# Altium project v3score.PrjPCB
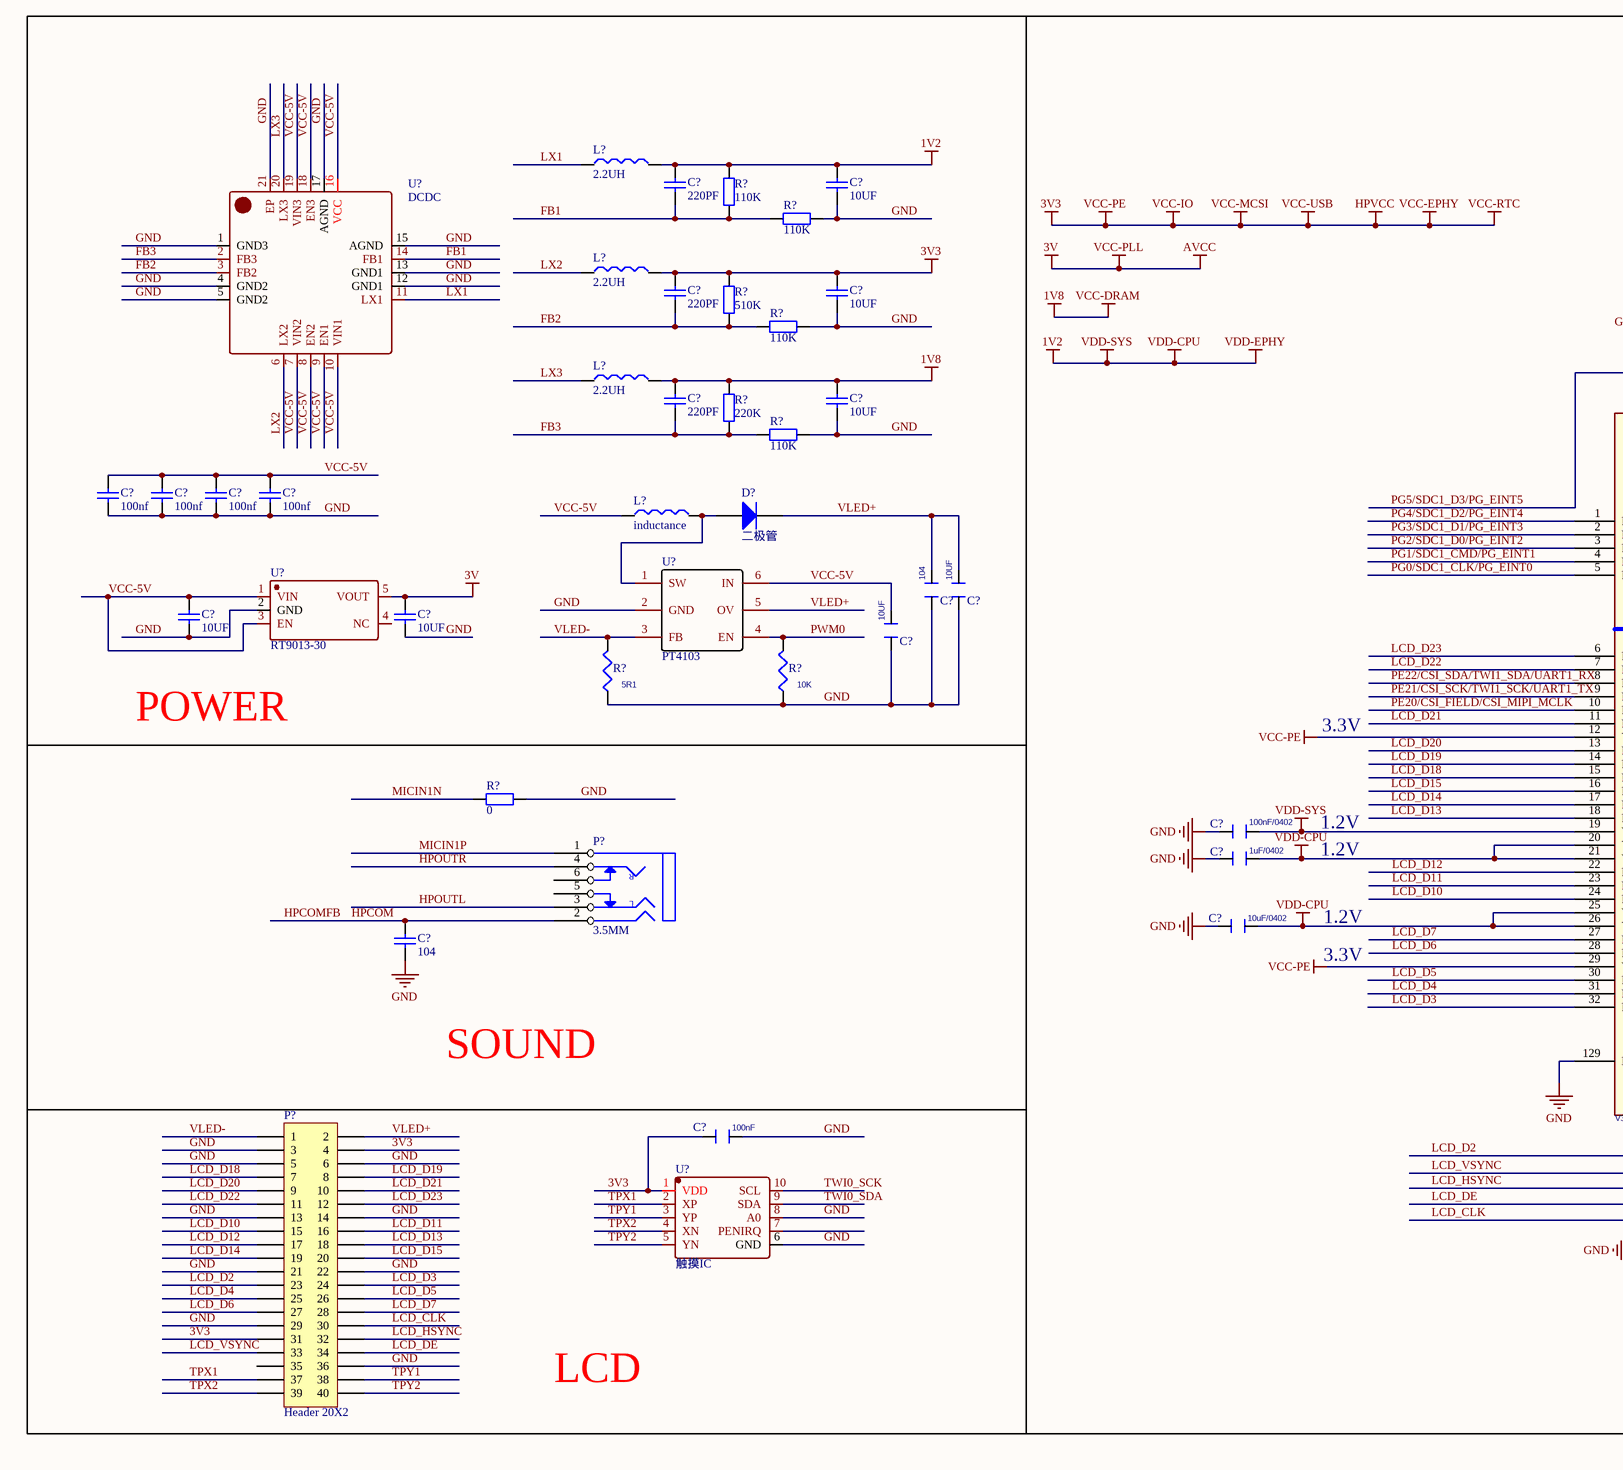
[diagram p0: v3score.SchDoc, left]
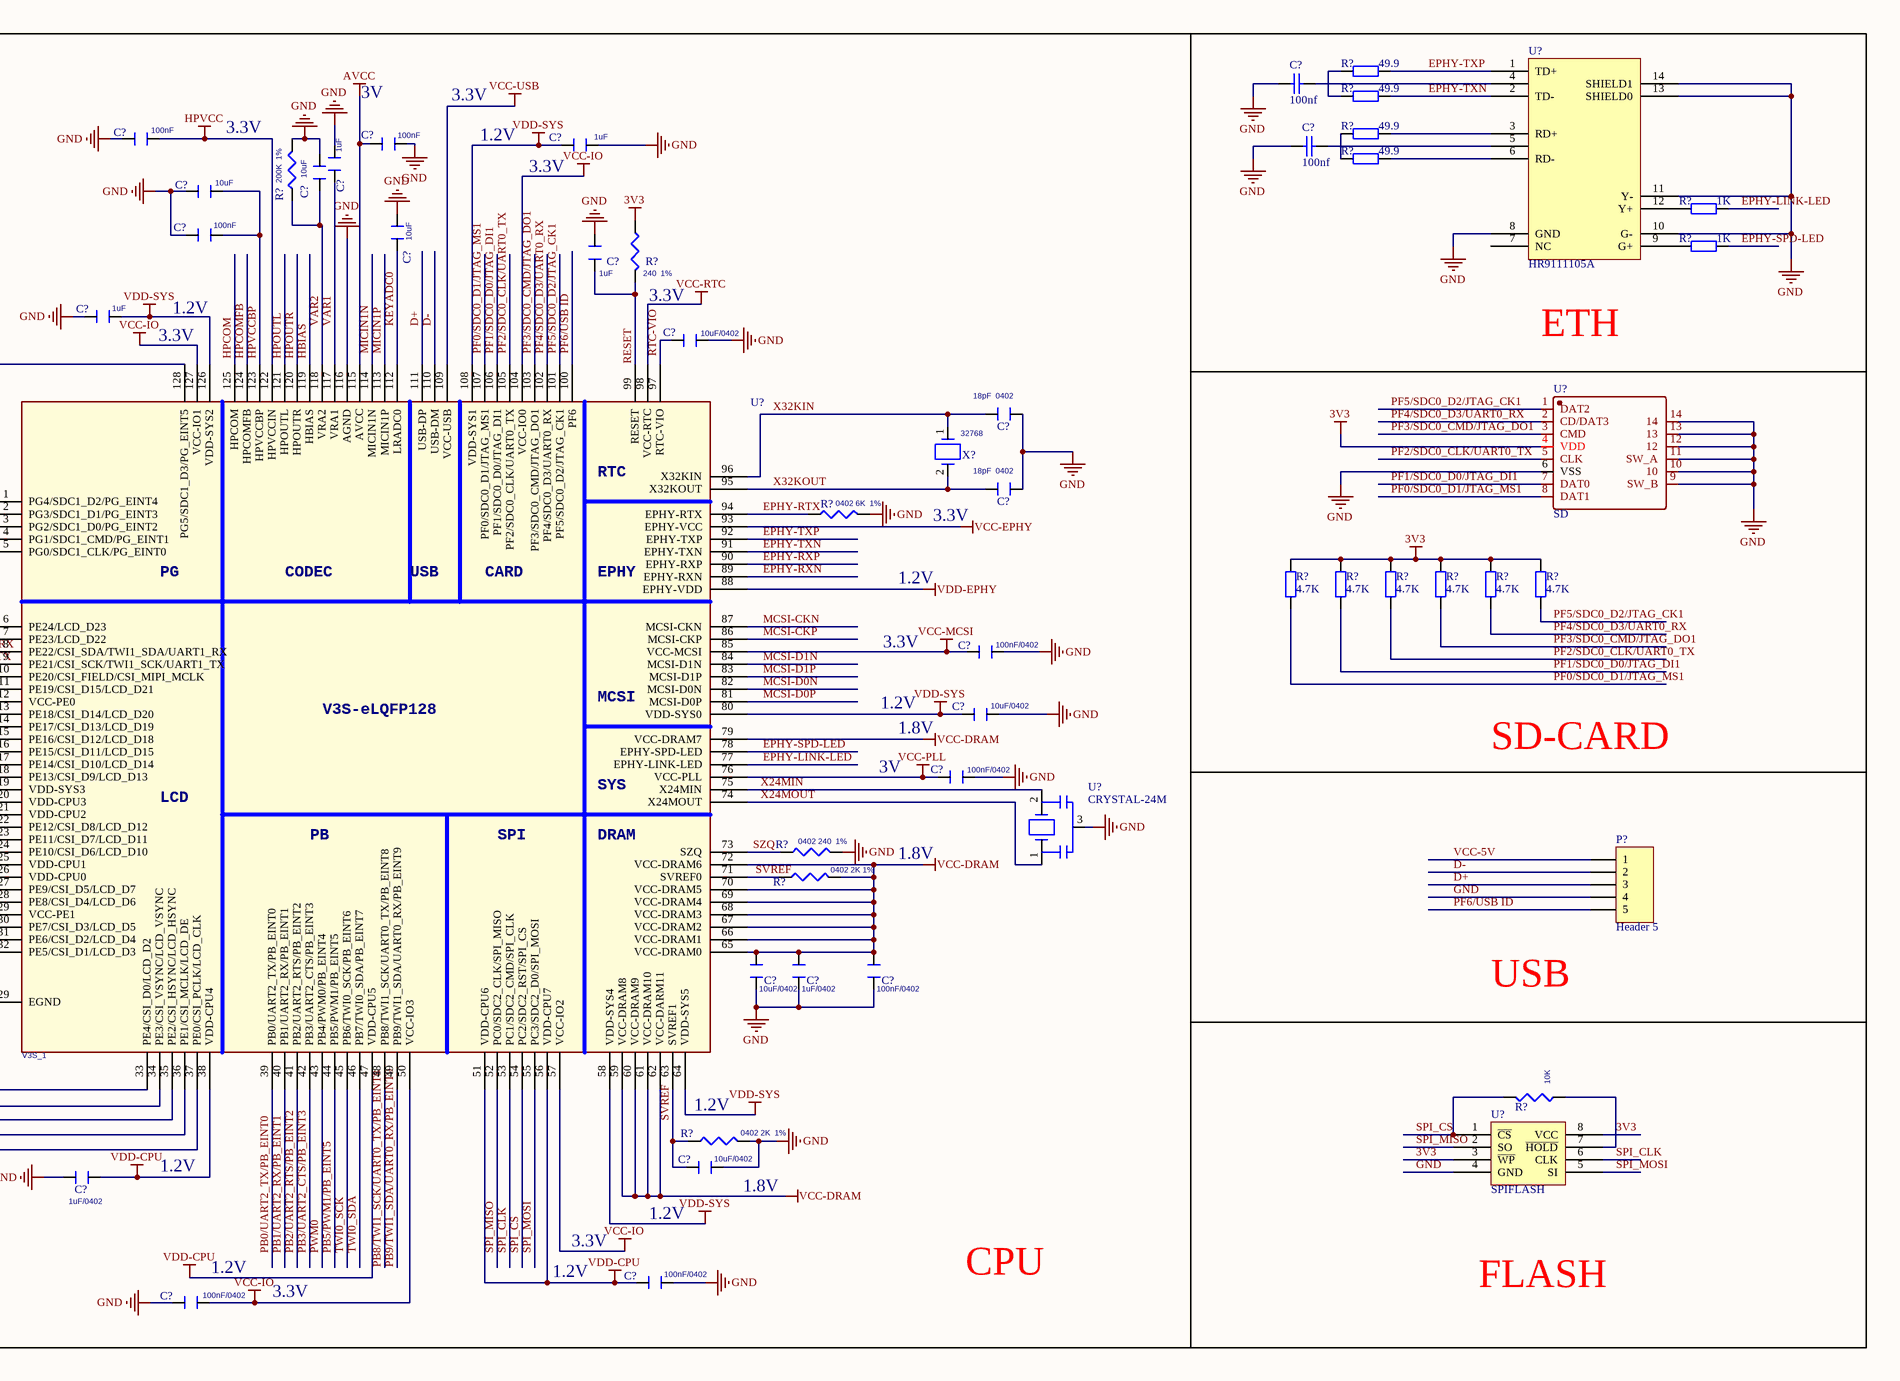
[diagram p1: v3score.SchDoc, right]
1 sheet, 91 parts. Net scope: global (net labels, ports and power ports of the same name join across sheets).
Board file: v3score.PcbDoc

## Sheet v3score.SchDoc
size A1

### Parts
(Parts that share a designator on the sheet are numbered #1, #2 ... from top to bottom, then left to right.)
C4  100nF  [R0603-LJN]
C5  100nF  [R0603-LJN]
C6  1uF  [R0603-LJN]
C8  10uF  [R0603-LJN]
C9  1uF  [R0603-LJN]
C10  10uF  [R0603-LJN]
C13  100nF  [R0603-LJN]
C15  10uF  [R0603-LJN]
C16  1uF  [R0603-LJN]
C19  1uF  [R0603-LJN]
C20  10uF/0402  [R0603-LJN]
C22  18pF  0402  [R0603-LJN]
C23  18pF  0402  [R0603-LJN]
C24  100nF/0402  [R0603-LJN]
C28  10uF/0402  [R0603-LJN]
C31  100nF/0402  [R0603-LJN]
C32  100nF/0402  [R0603-LJN]
C33  1uF/0402  [R0603-LJN]
C34  10uF/0402  [R0603-LJN]
C35  10uF/0402  [R0603-LJN]
C36  1uF/0402  [R0603-LJN]
C37  100nF/0402  [R0603-LJN]
C38  10uF/0402  [R0603-LJN]
C39  1uF/0402  [R0603-LJN]
C41  100nF/0402  [R0603-LJN]
C42  100nF/0402  [R0603-LJN]
C?#1  100nf  [R0603-LJN]
C?#2  100nf  [R0603-LJN]
C?#3  220PF  [R0603-LJN]
C?#4  10UF  [R0603-LJN]
C?#5  220PF  [R0603-LJN]
C?#6  10UF  [R0603-LJN]
C?#7  220PF  [R0603-LJN]
C?#8  10UF  [R0603-LJN]
C?#9  100nf  [R0603-LJN]
C?#10  100nf  [R0603-LJN]
C?#11  100nf  [R0603-LJN]
C?#12  100nf  [R0603-LJN]
C?#13  104  [R0603-LJN]
C?#14  10UF  [R0603-LJN]
C?#15  10UF  [R0603-LJN]
C?#16  10UF  [R0603-LJN]
C?#17  10UF  [R0603-LJN]
C?#18  104  [R0603-LJN]
C?#19  100nF  [R0603-LJN]
D?  二极管  [SOD-123]
L?#1  2.2UH  [C0805-LJN]
L?#2  2.2UH  [C0805-LJN]
L?#3  2.2UH  [C0805-LJN]
L?#4  inductance
P?#1  3.5MM  [PJ3537-3.5MM-LJN]
P?#2  Header 5  [USB-A/F-LJN]
P?#3  Header 20X2  [HDR2X20]
R4  200K  1%  [R0603-LJN]
R6  240  1%  [R0603-LJN]
R9  0402 6K  1%  [R0603-LJN]
R12  0402 240  1%  [R0603-LJN]
R13  0402 2K 1%  [R0603-LJN]
R14  0402 2K  1%  [R0603-LJN]
R?#1  49.9  [R0603-LJN]
R?#2  49.9  [R0603-LJN]
R?#3  49.9  [R0603-LJN]
R?#4  110K  [R0603-LJN]
R?#5  49.9  [R0603-LJN]
R?#6  110K  [R0603-LJN]
R?#7  1K  [R0603-LJN]
R?#8  1K  [R0603-LJN]
R?#9  510K  [R0603-LJN]
R?#10  110K  [R0603-LJN]
R?#11  220K  [R0603-LJN]
R?#12  110K  [R0603-LJN]
R?#13  4.7K  [R0603-LJN]
R?#14  4.7K  [R0603-LJN]
R?#15  4.7K  [R0603-LJN]
R?#16  4.7K  [R0603-LJN]
R?#17  4.7K  [R0603-LJN]
R?#18  4.7K  [R0603-LJN]
R?#19  5R1  [R0603-LJN]
R?#20  10K  [R0603-LJN]
R?#21  0  [R0603-LJN]
R?#22  10K  [R0603-LJN]
U2  V3S_1  [eLQFP128-V3S-LJN]
U5  CRYSTAL-24M  [X5032-LJN]
U?#1  HR9111105A
U?#2  DCDC  [QFN-20-LJN]
U?#3  SD  [SD-TF-14P-LJN]
U?#4  RT9013-30  [SOT23-5-LI]
U?#5  PT4103  [SOT23-6-LJN]
U?#6  触摸IC  [SSOP10-LJN]
U?#7  SPIFLASH  [SOP8150MIL-LJN]
X1  32768  [X5032-LJN]

### Blocks framed on the sheet
CPU: C4-C6 C8-C10 C13 C15 C16 C19 C20 C22-C24 C28 C31-C39 C41 C42 R4 R6 R9 R12-R14 U2 U5 X1

### Nets
1V2: C6.2 C19.2 C28.2 C32.2 C33.2 C34.2 C39.2 C41.1 C?#3.2 C?#4.2 L?#1.2 R?#4.1 U2.19(VDD-SYS3) U2.20(VDD-CPU3) U2.21(VDD-CPU2) U2.25(VDD-CPU1) U2.26(VDD-CPU0) U2.38(VDD-CPU4) U2.47(VDD-CPU5) U2.51(VDD-CPU6) U2.56(VDD-CPU7) U2.58(VDD-SYS4) U2.64(VDD-SYS5) U2.80(VDD-SYS0) U2.88(EPHY-VDD) U2.108(VDD-SYS1) U2.126(VDD-SYS2)  [also labelled VDD-CPU, VDD-EPHY, VDD-SYS]
1V8: C35.2 C36.2 C37.2 C?#7.2 C?#8.2 L?#3.2 R13.2 R?#11.1 U2.59(VCC-DRAM8) U2.60(VCC-DRAM9) U2.61(VCC-DRAM10) U2.62(VCC-DARM11) U2.65(VCC-DRAM0) U2.66(VCC-DRAM1) U2.67(VCC-DRAM2) U2.68(VCC-DRAM3) U2.69(VCC-DRAM4) U2.70(VCC-DRAM5) U2.72(VCC-DRAM6) U2.79(VCC-DRAM7)  [also labelled VCC-DRAM]
3V: C5.2 C31.2 C?#17.2 U2.76(VCC-PLL) U2.115(AVCC) U?#4.5(VOUT)  [also labelled AVCC, VCC-PLL]
3V3: C4.2 C24.2 C42.2 C?#5.2 C?#6.2 C?#19.2 L?#2.2 P?#3.4 P?#3.31 R6.1 R?#9.1 R?#13.2 R?#14.2 R?#15.2 R?#16.2 R?#17.2 R?#18.2 R?#22.1 U2.12(VCC-PE0) U2.29(VCC-PE1) U2.50(VCC-IO3) U2.57(VCC-IO2) U2.85(VCC-MCSI) U2.93(EPHY-VCC) U2.98(VCC-RTC) U2.104(VCC-IO0) U2.109(VCC-USB) U2.122(HPVCCIN) U2.127(VCC-IO1) U?#3.4(VDD) U?#6.1(VDD) U?#7.3(~{WP}) U?#7.7(~{HOLD}) U?#7.8(VCC)  [also labelled HPVCC, VCC-EPHY, VCC-IO, VCC-MCSI, VCC-PE, VCC-RTC, VCC-USB]
GND: C4.1 C5.1 C6.1 C8.1 C9.1 C10.1 C13.1 C15.1 C16.1 C19.1 C20.2 C22.2 C23.2 C24.1 C28.1 C31.1 C32.1 C33.1 C34.1 C35.1 C36.1 C37.1 C38.1 C39.1 C41.2 C42.1 C?#1.1 C?#2.1 C?#4.1 C?#6.1 C?#8.1 C?#9.1 C?#10.1 C?#11.1 C?#12.1 C?#13.2 C?#14.2 C?#15.2 C?#16.1 C?#17.1 C?#18.2 C?#19.1 P?#2.4 P?#3.3 P?#3.5 P?#3.6 P?#3.13 P?#3.14 P?#3.21 P?#3.22 P?#3.29 P?#3.36 R4.2 R9.2 R12.2 R14.2 R?#6.1 R?#10.1 R?#12.1 R?#19.1 R?#20.1 R?#21.1 U2.116(AGND) U2.129(EGND) U5.3(Shield) U?#1.8(GND) U?#1.10(G-) U?#1.11(Y-) U?#1.13(SHIELD0) U?#1.14(SHIELD1) U?#2.1(GND3) U?#2.4(GND2) U?#2.5(GND2) U?#2.12(GND1) U?#2.13(GND1) U?#2.15(AGND) U?#2.17(AGND) U?#2.21(EP) U?#3.6(VSS) U?#3.9(SW_B) U?#3.10 U?#3.11(SW_A) U?#3.12 U?#3.13 U?#3.14 U?#4.2(GND) U?#5.2(GND) U?#6.6(GND) U?#6.8(A0) U?#7.4(GND)
D+: P?#2.3 U2.111(USB-DP)
D-: P?#2.2 U2.110(USB-DM)
EPHY-LINK-LED: R?#7.2 U2.77(EPHY-LINK-LED)
EPHY-RTX: R9.1 U2.94(EPHY-RTX)
EPHY-RXN: U2.89(EPHY-RXN)
EPHY-RXP: U2.90(EPHY-RXP)
EPHY-SPD-LED: R?#8.2 U2.78(EPHY-SPD-LED)
EPHY-TXN: R?#2.2 U2.91(EPHY-TXN) U?#1.2(TD-)
EPHY-TXP: R?#1.2 U2.92(EPHY-TXP) U?#1.1(TD+)
FB1: C?#3.1 R?#4.2 R?#6.2 U?#2.14(FB1)
FB2: C?#5.1 R?#9.2 R?#10.2 U?#2.3(FB2)
FB3: C?#7.1 R?#11.2 R?#12.2 U?#2.2(FB3)
HBIAS: U2.119(HBIAS)
HPCOM: C?#18.1 P?#1.2 U2.124(HPCOMFB) U2.125(HPCOM)  [also labelled HPCOMFB]
HPOUTL: P?#1.3(A) U2.121(HPOUTL)
HPOUTR: P?#1.4(D) U2.120(HPOUTR)
HPVCCBP: C8.2 C13.2 U2.123(HPVCCBP)
KEYADC0: C15.2 U2.112(LRADC0)
LCD_CLK: P?#3.30 U2.37(PE0/CSI_PCLK/LCD_CLK)
LCD_D2: P?#3.23 U2.33(PE4/CSI_D0/LCD_D2)
LCD_D3: P?#3.24 U2.32(PE5/CSI_D1/LCD_D3)
LCD_D4: P?#3.25 U2.31(PE6/CSI_D2/LCD_D4)
LCD_D5: P?#3.26 U2.30(PE7/CSI_D3/LCD_D5)
LCD_D6: P?#3.27 U2.28(PE8/CSI_D4/LCD_D6)
LCD_D7: P?#3.28 U2.27(PE9/CSI_D5/LCD_D7)
LCD_D10: P?#3.15 U2.24(PE10/CSI_D6/LCD_D10)
LCD_D11: P?#3.16 U2.23(PE11/CSI_D7/LCD_D11)
LCD_D12: P?#3.17 U2.22(PE12/CSI_D8/LCD_D12)
LCD_D13: P?#3.18 U2.18(PE13/CSI_D9/LCD_D13)
LCD_D14: P?#3.19 U2.17(PE14/CSI_D10/LCD_D14)
LCD_D15: P?#3.20 U2.16(PE15/CSI_D11/LCD_D15)
LCD_D18: P?#3.7 U2.15(PE16/CSI_D12/LCD_D18)
LCD_D19: P?#3.8 U2.14(PE17/CSI_D13/LCD_D19)
LCD_D20: P?#3.9 U2.13(PE18/CSI_D14/LCD_D20)
LCD_D21: P?#3.10 U2.11(PE19/CSI_D15/LCD_D21)
LCD_D22: P?#3.11 U2.7(PE23/LCD_D22)
LCD_D23: P?#3.12 U2.6(PE24/LCD_D23)
LCD_DE: P?#3.34 U2.36(PE1/CSI_MCLK/LCD_DE)
LCD_HSYNC: P?#3.32 U2.35(PE2/CSI_HSYNC/LCD_HSYNC)
LCD_VSYNC: P?#3.33 U2.34(PE3/CSI_VSYNC/LCD_VSYNC)
LX1: L?#1.1 U?#2.11(LX1)
LX2: L?#2.1 U?#2.6(LX2)
LX3: L?#3.1 U?#2.20(LX3)
MCSI-CKN: U2.87(MCSI-CKN)
MCSI-CKP: U2.86(MCSI-CKP)
MCSI-D0N: U2.82(MCSI-D0N)
MCSI-D0P: U2.81(MCSI-D0P)
MCSI-D1N: U2.84(MCSI-D1N)
MCSI-D1P: U2.83(MCSI-D1P)
MICIN1N: R?#21.2 U2.114(MICIN1N)
MICIN1P: P?#1.1(E) U2.113(MICIN1P)
PB0/UART2_TX/PB_EINT0: U2.39(PB0/UART2_TX/PB_EINT0)
PB1/UART2_RX/PB_EINT1: U2.40(PB1/UART2_RX/PB_EINT1)
PB2/UART2_RTS/PB_EINT2: U2.41(PB2/UART2_RTS/PB_EINT2)
PB3/UART2_CTS/PB_EINT3: U2.42(PB3/UART2_CTS/PB_EINT3)
PB5/PWM1/PB_EINT5: U2.44(PB5/PWM1/PB_EINT5)
PB8/TWI1_SCK/UART0_TX/PB_EINT8: U2.48(PB8/TWI1_SCK/UART0_TX/PB_EINT8)
PB9/TWI1_SDA/UART0_RX/PB_EINT9: U2.49(PB9/TWI1_SDA/UART0_RX/PB_EINT9)
PE20/CSI_FIELD/CSI_MIPI_MCLK: U2.10(PE20/CSI_FIELD/CSI_MIPI_MCLK)
PE21/CSI_SCK/TWI1_SCK/UART1_TX: U2.9(PE21/CSI_SCK/TWI1_SCK/UART1_TX)
PE22/CSI_SDA/TWI1_SDA/UART1_RX: U2.8(PE22/CSI_SDA/TWI1_SDA/UART1_RX)
PF0/SDC0_D1/JTAG_MS1: R?#13.1 U2.107(PF0/SDC0_D1/JTAG_MS1) U?#3.8(DAT1)
PF1/SDC0_D0/JTAG_DI1: R?#14.1 U2.106(PF1/SDC0_D0/JTAG_DI1) U?#3.7(DAT0)
PF2/SDC0_CLK/UART0_TX: R?#15.1 U2.105(PF2/SDC0_CLK/UART0_TX) U?#3.5(CLK)
PF3/SDC0_CMD/JTAG_DO1: R?#16.1 U2.103(PF3/SDC0_CMD/JTAG_DO1) U?#3.3(CMD)
PF4/SDC0_D3/UART0_RX: R?#17.1 U2.102(PF4/SDC0_D3/UART0_RX) U?#3.2(CD/DAT3)
PF5/SDC0_D2/JTAG_CK1: R?#18.1 U2.101(PF5/SDC0_D2/JTAG_CK1) U?#3.1(DAT2)
PF6/USB ID: P?#2.5 U2.100(PF6)
PG0/SDC1_CLK/PG_EINT0: U2.5(PG0/SDC1_CLK/PG_EINT0)
PG1/SDC1_CMD/PG_EINT1: U2.4(PG1/SDC1_CMD/PG_EINT1)
PG2/SDC1_D0/PG_EINT2: U2.3(PG2/SDC1_D0/PG_EINT2)
PG3/SDC1_D1/PG_EINT3: U2.2(PG3/SDC1_D1/PG_EINT3)
PG4/SDC1_D2/PG_EINT4: U2.1(PG4/SDC1_D2/PG_EINT4)
PG5/SDC1_D3/PG_EINT5: U2.128(PG5/SDC1_D3/PG_EINT5)
PWM0: R?#20.2 U2.43(PB4/PWM0/PB_EINT4) U?#5.4(EN)
RESET: C16.2 R6.2 U2.99(RESET)
RTC-VIO: C20.1 U2.97(RTC-VIO)
SPI_CLK: U2.53(PC1/SDC2_CMD/SPI_CLK) U?#7.6(CLK)
SPI_CS: R?#22.2 U2.54(PC2/SDC2_RST/SPI_CS) U?#7.1(~{CS})
SPI_MISO: U2.52(PC0/SDC2_CLK/SPI_MISO) U?#7.2(SO)
SPI_MOSI: U2.55(PC3/SDC2_D0/SPI_MOSI) U?#7.5(SI)
SVREF: C38.2 R13.1 R14.1 U2.63(SVREF1) U2.71(SVREF0)
SZQ: R12.1 U2.73(SZQ)
TPX1: P?#3.37 U?#6.2(XP)
TPX2: P?#3.39 U?#6.4(XN)
TPY1: P?#3.38 U?#6.3(YP)
TPY2: P?#3.40 U?#6.5(YN)
TWI0_SCK: U2.45(PB6/TWI0_SCK/PB_EINT6) U?#6.10(SCL)
TWI0_SDA: U2.46(PB7/TWI0_SDA/PB_EINT7) U?#6.9(SDA)
VAR1: C9.2 U2.117(VRA1)
VAR2: C10.2 R4.1 U2.118(VRA2)
VCC-5V: C?#9.2 C?#10.2 C?#11.2 C?#12.2 C?#15.1 C?#16.2 L?#4.1 P?#2.1 U?#2.7(VIN2) U?#2.8(EN2) U?#2.9(EN1) U?#2.10(VIN1) U?#2.16(VCC) U?#2.18(EN3) U?#2.19(VIN3) U?#4.1(VIN) U?#4.3(EN) U?#5.6(IN)
VLED+: C?#13.1 C?#14.1 D?.2(K) P?#3.2 U?#5.5(OV)
VLED-: P?#3.1 R?#19.2 U?#5.3(FB)
X24MIN: U2.75(X24MIN) U5.2
X24MOUT: U2.74(X24MOUT) U5.1
X32KIN: C22.1 U2.96(X32KIN) X1.1
X32KOUT: C23.1 U2.95(X32KOUT) X1.2
NetC?#1_2: C?#1.2 U?#1.4
NetC?#2_2: C?#2.2 U?#1.5
NetD?_1: D?.1(A) L?#4.2 U?#5.1(SW)
NetR?#1_1: R?#1.1 R?#2.1
NetR?#3_1: R?#3.1 R?#5.1
NetR?#3_2: R?#3.2 U?#1.3(RD+)
NetR?#5_2: R?#5.2 U?#1.6(RD-)
NetR?#7_1: R?#7.1 U?#1.12(Y+)
NetR?#8_1: R?#8.1 U?#1.9(G+)

Not connected (* = marked no-connect by the designer): P?#1 5(B) 6(C); P?#3 35; U?#1 7(NC); U?#4 4(NC); U?#6 7(PENIRQ)

### Notes on the sheet
- (near R4) 3.3V
- (near C5) 3V
- 3.3V
- 1.2V
- (near C6) 3.3V
- ETH
- POWER
- (near C28) 1.8V
- SD-CARD
- 3V
- 1.8V
- SOUND
- USB
- (near R14) 1.2V
- (near C38) 1.2V
- LCD
- (near C42) 1.2V
- FLASH
- (in symbol PJ3537-3.5MM) R; L
- (in symbol V3S_1) RTC; PG; CODEC; USB; CARD; EPHY; MCSI; V3S-eLQFP128; SYS; LCD; PB; SPI; DRAM

### Library data of the parts
C4-C6 C8-C10 C13 C15 C16 C19 C20 C24 C28 C31-C39 C41 C42 C?#13-C?#15 C?#19 = CAPACITOR_0
C22 C23 = CAPACITOR_Dup1
C?#1-C?#12 C?#16-C?#18 = CAP
D? = DIODE
L?#1-L?#3 = Inductance
P?#1 = PJ3537-3.5MM
P?#2 = Header 5: Header, 5-Pin; LatestRevisionDate: 17-Jul-2002; LatestRevisionNote: Re-released for DXP Platform.; Publisher: Altium Limited
P?#3 = Header 20X2: Header, 20-Pin, Dual row; LatestRevisionDate: 17-Jul-2002; LatestRevisionNote: Re-released for DXP Platform.; Publisher: Altium Limited
R4 R6 R9 R12-R14 R?#19 R?#20 R?#22 = R1 0805
R?#1-R?#18 R?#21 = RES
U?#2 = EA3036
U?#3 = SDCARD
U?#6 = NS2009
X1 = CRYSTAL_XCOL-3